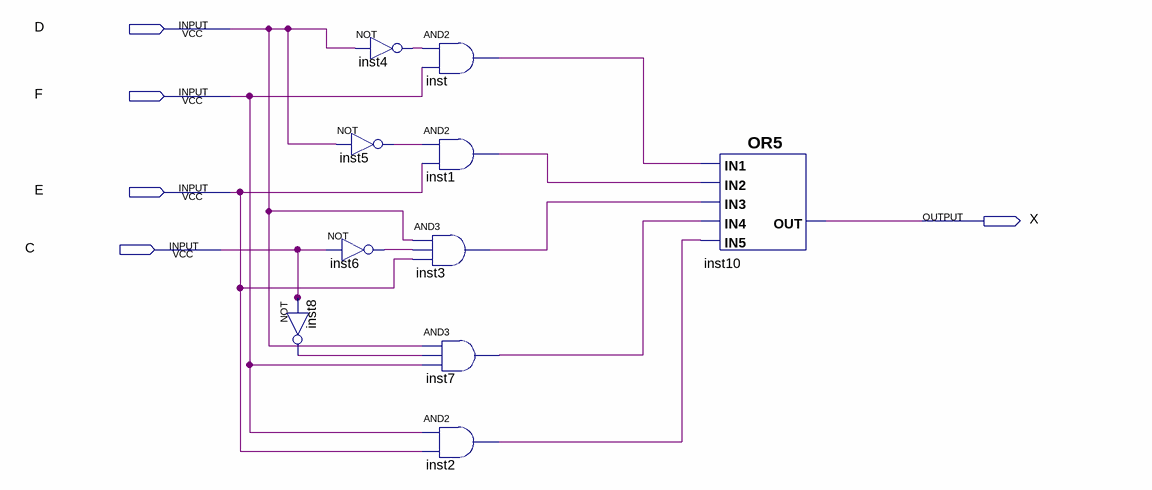
[diagram p0: schematic sheet]
// Quartus schematic KOMa0b0.bdf as structural Verilog: 10 symbols, 5 pins
module KOMa0b0 (
  input  D,
  input  F,
  input  E,
  input  C,
  output X
);

  wire inst1_out, inst2_out, inst3_out, inst4_out, inst5_out, inst6_out, inst7_out, inst8_out, inst_out;

  not inst8 (inst8_out, C);
  not inst4 (inst4_out, D);
  not inst5 (inst5_out, D);
  not inst6 (inst6_out, C);
  and inst (inst_out, inst4_out, F);
  and inst1 (inst1_out, inst5_out, E);
  and inst3 (inst3_out, D, inst6_out, E);
  and inst7 (inst7_out, D, inst8_out, F);
  and inst2 (inst2_out, F, E);
  or inst10 (X, inst_out, inst1_out, inst3_out, inst7_out, inst2_out);
endmodule
